# Altium schematic sheet RT9013-33G.schdoc
size 55 x 40 mm
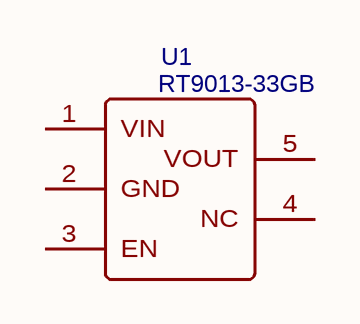
[diagram p0: RT9013-33G.schdoc]

## Parts
U1  RT9013-33GB  [SOT-23-5_L3.0-W1.7-P0.95-LS2.8-BR]

## Nets

Not connected (* = marked no-connect by the designer): U1 1(VIN) 2(GND) 3(EN) 4(NC) 5(VOUT)

## Library data of the parts
U1 = RT9013-33GB: BOM_Manufacturer: RICHTEK; BOM_Supplier: LCSC; BOM_Manufacturer Part: RT9013-33GB; BOM_Supplier Part: C47773; BOM_JLCPCB Part Class: Extended Part; spicePre: U; spiceSymbolName: RT9013-33GB